# Altium schematic sheet 0195_GPP_MUX_D.SchDoc
size A3
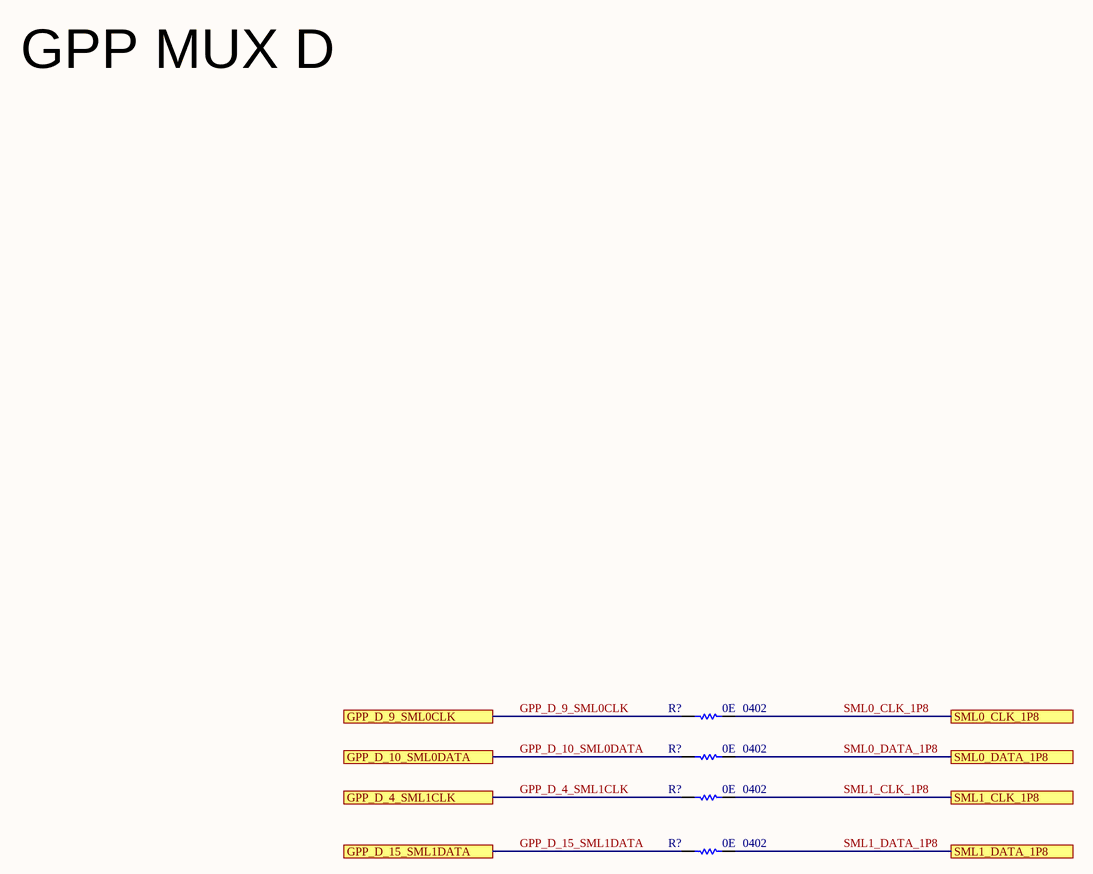
[diagram p0: 0195_GPP_MUX_D.SchDoc]

## Parts
(Parts that share a designator on the sheet are numbered #1, #2 ... from top to bottom, then left to right.)
R?#1  value 0E  Case/Package: 0402  [RESC0402]  (hidden comment: Res)
R?#2  value 0E  Case/Package: 0402  [RESC0402]  (hidden comment: Res)
R?#3  value 0E  Case/Package: 0402  [RESC0402]  (hidden comment: Res)
R?#4  value 0E  Case/Package: 0402  [RESC0402]  (hidden comment: Res)

## Ports
GPP_D_4_SML1CLK, GPP_D_9_SML0CLK, GPP_D_10_SML0DATA, GPP_D_15_SML1DATA, SML0_CLK_1P8, SML0_DATA_1P8, SML1_CLK_1P8, SML1_DATA_1P8

## Nets
GPP_D_4_SML1CLK: R?#3.1 ; port GPP_D_4_SML1CLK
GPP_D_9_SML0CLK: R?#1.1 ; port GPP_D_9_SML0CLK
GPP_D_10_SML0DATA: R?#2.1 ; port GPP_D_10_SML0DATA
GPP_D_15_SML1DATA: R?#4.1 ; port GPP_D_15_SML1DATA
SML0_CLK_1P8: R?#1.2 ; port SML0_CLK_1P8
SML0_DATA_1P8: R?#2.2 ; port SML0_DATA_1P8
SML1_CLK_1P8: R?#3.2 ; port SML1_CLK_1P8
SML1_DATA_1P8: R?#4.2 ; port SML1_DATA_1P8

## Notes on the sheet
- GPP MUX D

## Library data of the parts
R?#1-R?#4 = Res: Thick Film Resistor -  0ohm, 1%, 0402